# Altium schematic sheet EVK-IRIS-W1-MCULINK-MUX.SchDoc
size A3; DocumentNumber: 6; SheetNumber: 6; SheetTotal: 14
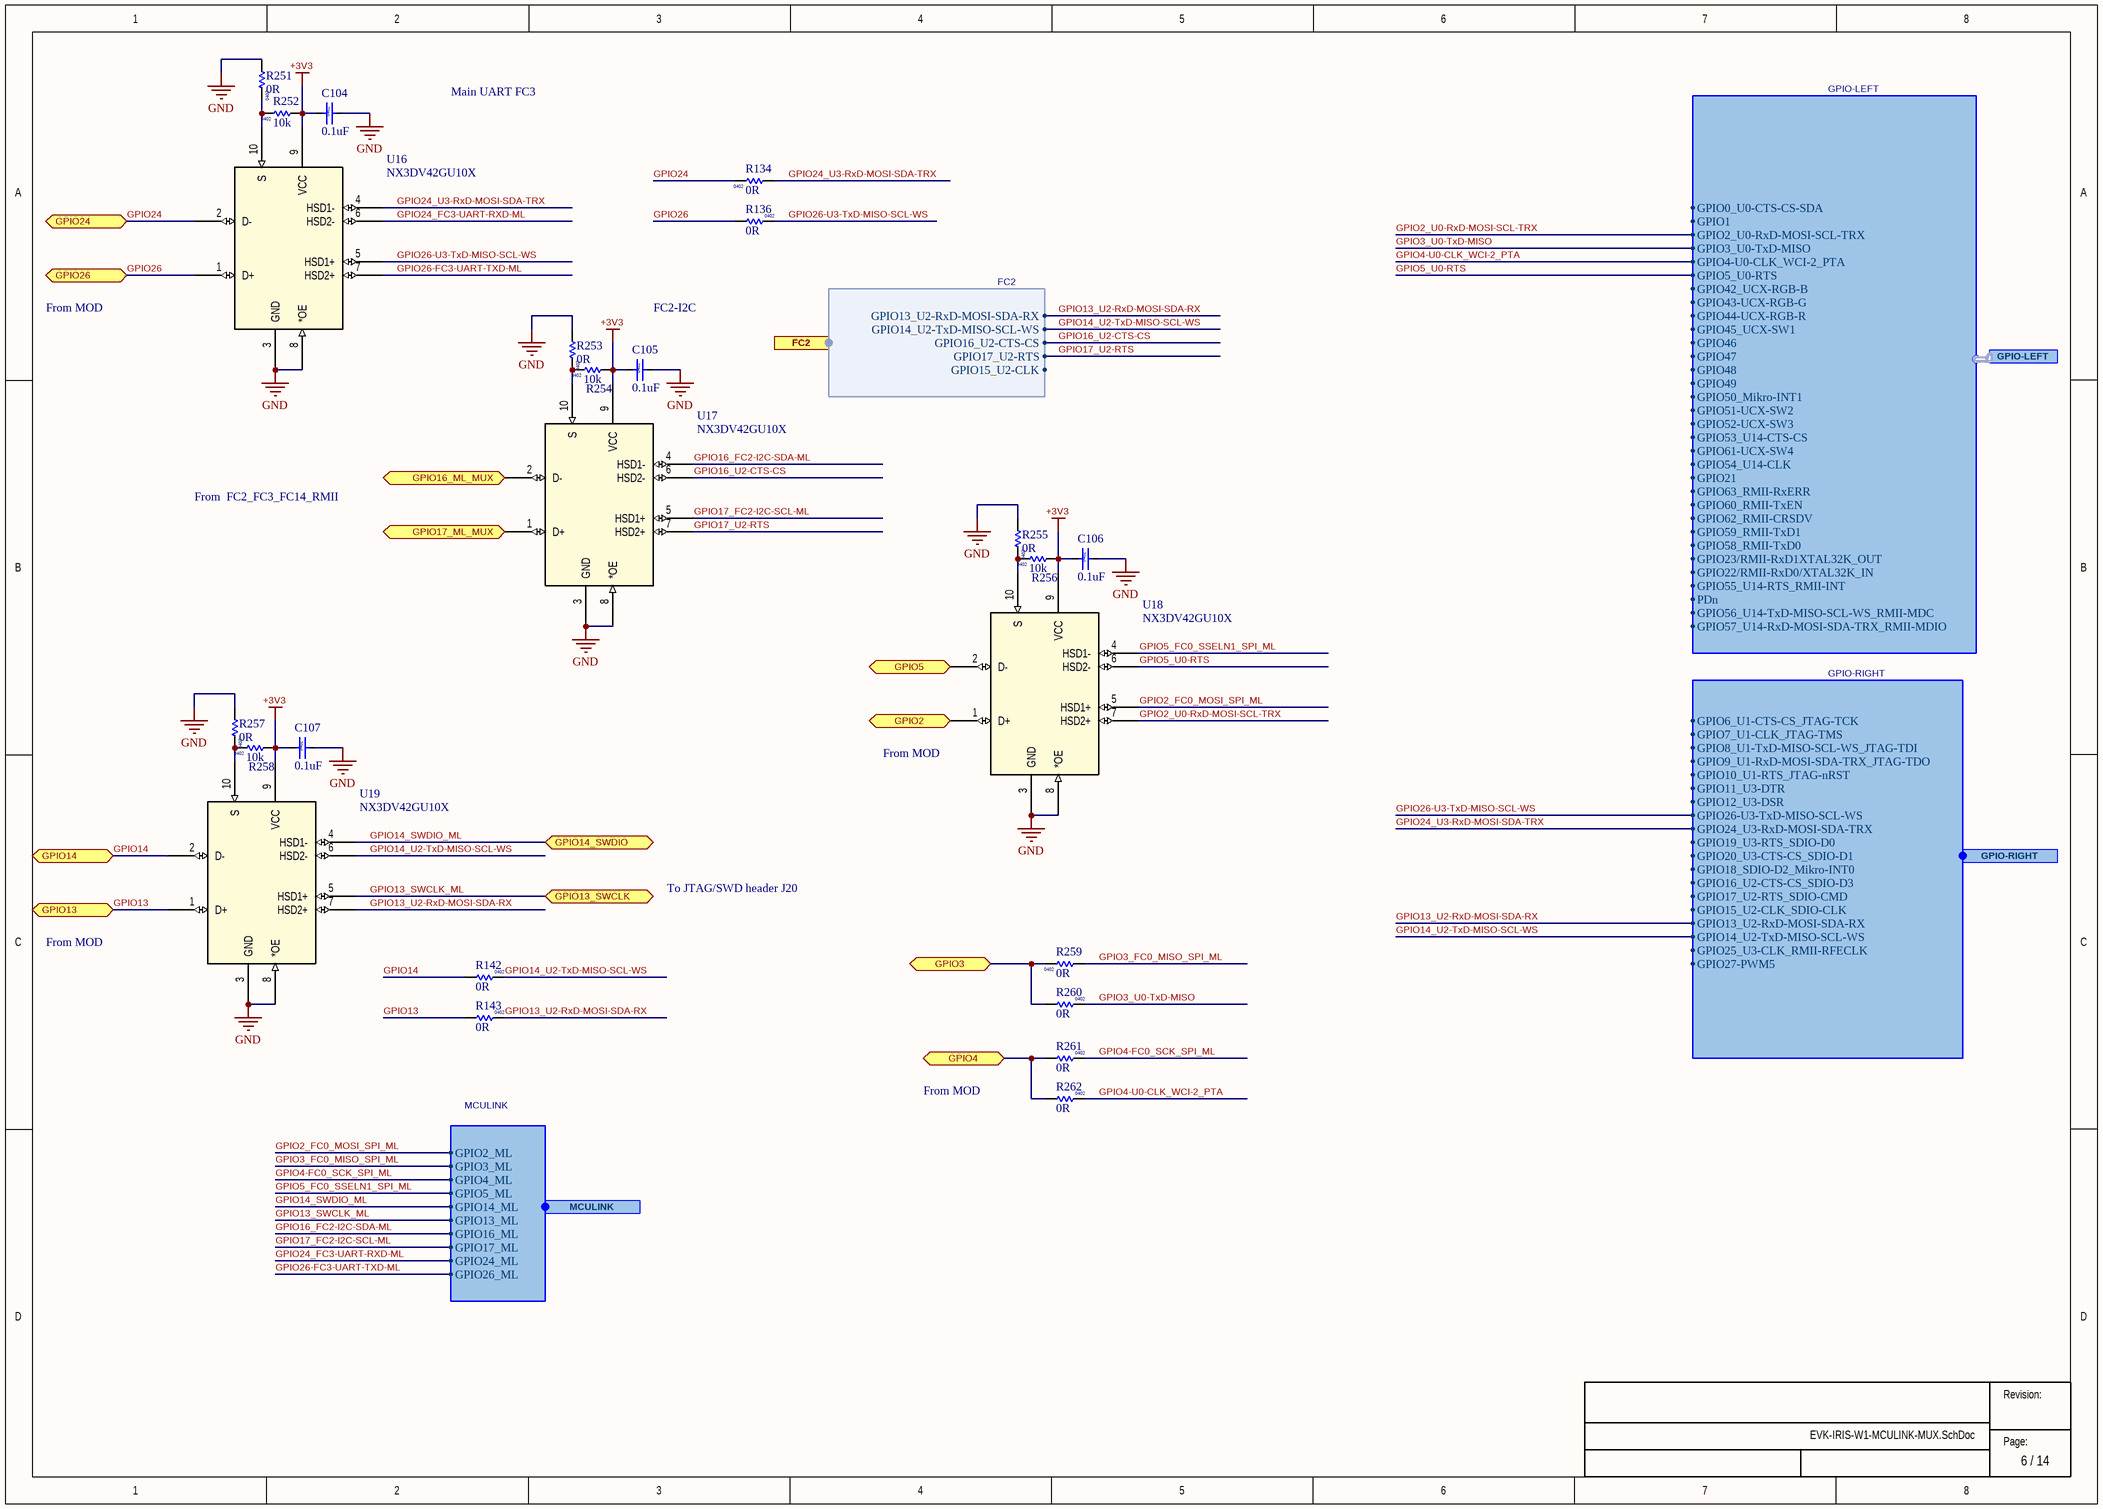
[diagram p0: EVK-IRIS-W1-MCULINK-MUX.SchDoc]

## Parts
C104  value 0.1uF  Size: 0402  [Cap 0402 HD]
C105  value 0.1uF  Size: 0402  [Cap 0402 HD]
C106  value 0.1uF  Size: 0402  [Cap 0402 HD]
C107  value 0.1uF  Size: 0402  [Cap 0402 HD]
R134  value 0R  Size: 0402  [RES 0402 HD]
R136  value 0R  Size: 0402  [RES 0402 HD]
R142  value 0R  Size: 0402  [RES 0402 HD]
R143  value 0R  Size: 0402  [RES 0402 HD]
R251  value 0R  Size: 0402  [RES 0402 HD]
R252  value 10k  Size: 0402  [RES 0402 HD]
R253  value 0R  Size: 0402  [RES 0402 HD]
R254  value 10k  Size: 0402  [RES 0402 HD]
R255  value 0R  Size: 0402  [RES 0402 HD]
R256  value 10k  Size: 0402  [RES 0402 HD]
R257  value 0R  Size: 0402  [RES 0402 HD]
R258  value 10k  Size: 0402  [RES 0402 HD]
R259  value 0R  Size: 0402  [RES 0402 HD]
R260  value 0R  Size: 0402  [RES 0402 HD]
R261  value 0R  Size: 0402  [RES 0402 HD]
R262  value 0R  Size: 0402  [RES 0402 HD]
U16  NX3DV42GU10X  [XQFN10_SOT1337-1_NXP]
U17  NX3DV42GU10X  [XQFN10_SOT1337-1_NXP]
U18  NX3DV42GU10X  [XQFN10_SOT1337-1_NXP]
U19  NX3DV42GU10X  [XQFN10_SOT1337-1_NXP]

## Ports
FC2 (harness FC2), GPIO2 (bidir), GPIO3 (bidir), GPIO4 (bidir), GPIO5 (bidir), GPIO13 (bidir), GPIO13_SWCLK (bidir), GPIO14 (bidir), GPIO14_SWDIO (bidir), GPIO16_ML_MUX (bidir), GPIO17_ML_MUX (bidir), GPIO24 (bidir), GPIO26 (bidir), GPIO-LEFT (harness GPIO-LEFT), GPIO-RIGHT (harness GPIO-RIGHT), MCULINK (harness MCULINK)

## Harnesses
GPIO-RIGHT: GPIO6_U1-CTS-CS_JTAG-TCK, GPIO7_U1-CLK_JTAG-TMS, GPIO8_U1-TxD-MISO-SCL-WS_JTAG-TDI, GPIO9_U1-RxD-MOSI-SDA-TRX_JTAG-TDO, GPIO10_U1-RTS_JTAG-nRST, GPIO11_U3-DTR, GPIO12_U3-DSR, GPIO26-U3-TxD-MISO-SCL-WS, GPIO24_U3-RxD-MOSI-SDA-TRX, GPIO19_U3-RTS_SDIO-D0, GPIO20_U3-CTS-CS_SDIO-D1, GPIO18_SDIO-D2_Mikro-INT0, GPIO16_U2-CTS-CS_SDIO-D3, GPIO17_U2-RTS_SDIO-CMD, GPIO15_U2-CLK_SDIO-CLK, GPIO13_U2-RxD-MOSI-SDA-RX, GPIO14_U2-TxD-MISO-SCL-WS, GPIO25_U3-CLK_RMII-RFECLK, GPIO27-PWM5
GPIO-LEFT: GPIO0_U0-CTS-CS-SDA, GPIO1, GPIO2_U0-RxD-MOSI-SCL-TRX, GPIO3_U0-TxD-MISO, GPIO4-U0-CLK_WCI-2_PTA, GPIO5_U0-RTS, GPIO42_UCX-RGB-B, GPIO43-UCX-RGB-G, GPIO44-UCX-RGB-R, GPIO45_UCX-SW1, GPIO46, GPIO47, GPIO48, GPIO49, GPIO50_Mikro-INT1, GPIO51-UCX-SW2, GPIO52-UCX-SW3, GPIO53_U14-CTS-CS, GPIO61-UCX-SW4, GPIO54_U14-CLK, GPIO21, GPIO63_RMII-RxERR, GPIO60_RMII-TxEN, GPIO62_RMII-CRSDV, GPIO59_RMII-TxD1, GPIO58_RMII-TxD0, GPIO23/RMII-RxD1XTAL32K_OUT, GPIO22/RMII-RxD0/XTAL32K_IN, GPIO55_U14-RTS_RMII-INT, PDn, GPIO56_U14-TxD-MISO-SCL-WS_RMII-MDC, GPIO57_U14-RxD-MOSI-SDA-TRX_RMII-MDIO
MCULINK: GPIO2_ML, GPIO3_ML, GPIO4_ML, GPIO5_ML, GPIO13_ML, GPIO14_ML, GPIO16_ML, GPIO17_ML, GPIO24_ML, GPIO26_ML
FC2: GPIO13_U2-RxD-MOSI-SDA-RX, GPIO14_U2-TxD-MISO-SCL-WS, GPIO16_U2-CTS-CS, GPIO17_U2-RTS, GPIO15_U2-CLK

## Nets
+3V3: C104.1 C105.1 C106.1 C107.1 R252.1 R254.1 R256.1 R258.1 U16.9(VCC) U17.9(VCC) U18.9(VCC) U19.9(VCC)
GND: C104.2 C105.2 C106.2 C107.2 R251.1 R253.1 R255.1 R257.1 U16.3(GND) U16.8(*OE) U17.3(GND) U17.8(*OE) U18.3(GND) U18.8(*OE) U19.3(GND) U19.8(*OE)
GPIO2: U18.1(D+) ; port GPIO2
GPIO2_FC0_MOSI_SPI_ML: U18.5(HSD1+) ; port MCULINK.GPIO2_ML
GPIO2_U0-RxD-MOSI-SCL-TRX: U18.7(HSD2+) ; port GPIO-LEFT.GPIO2_U0-RxD-MOSI-SCL-TRX
GPIO3: R259.2 R260.1 ; port GPIO3
GPIO3_FC0_MISO_SPI_ML: R259.1 ; port MCULINK.GPIO3_ML
GPIO3_U0-TxD-MISO: R260.2 ; port GPIO-LEFT.GPIO3_U0-TxD-MISO
GPIO4: R261.1 R262.1 ; port GPIO4
GPIO4-FC0_SCK_SPI_ML: R261.2 ; port MCULINK.GPIO4_ML
GPIO4-U0-CLK_WCI-2_PTA: R262.2 ; port GPIO-LEFT.GPIO4-U0-CLK_WCI-2_PTA
GPIO5: U18.2(D-) ; port GPIO5
GPIO5_FC0_SSELN1_SPI_ML: U18.4(HSD1-) ; port MCULINK.GPIO5_ML
GPIO5_U0-RTS: U18.6(HSD2-) ; port GPIO-LEFT.GPIO5_U0-RTS
GPIO13: R143.1 U19.1(D+) ; port GPIO13
GPIO13_SWCLK_ML: U19.5(HSD1+) ; port GPIO13_SWCLK, port MCULINK.GPIO13_ML
GPIO13_U2-RxD-MOSI-SDA-RX: R143.2 U19.7(HSD2+) ; port GPIO-RIGHT.GPIO13_U2-RxD-MOSI-SDA-RX, port FC2.GPIO13_U2-RxD-MOSI-SDA-RX
GPIO14: R142.1 U19.2(D-) ; port GPIO14
GPIO14_SWDIO_ML: U19.4(HSD1-) ; port GPIO14_SWDIO, port MCULINK.GPIO14_ML
GPIO14_U2-TxD-MISO-SCL-WS: R142.2 U19.6(HSD2-) ; port GPIO-RIGHT.GPIO14_U2-TxD-MISO-SCL-WS, port FC2.GPIO14_U2-TxD-MISO-SCL-WS
GPIO16_FC2-I2C-SDA-ML: U17.4(HSD1-) ; port MCULINK.GPIO16_ML
GPIO16_ML_MUX: U17.2(D-) ; port GPIO16_ML_MUX
GPIO16_U2-CTS-CS: U17.6(HSD2-) ; port FC2.GPIO16_U2-CTS-CS
GPIO17_FC2-I2C-SCL-ML: U17.5(HSD1+) ; port MCULINK.GPIO17_ML
GPIO17_ML_MUX: U17.1(D+) ; port GPIO17_ML_MUX
GPIO17_U2-RTS: U17.7(HSD2+) ; port FC2.GPIO17_U2-RTS
GPIO24: R134.2 U16.2(D-) ; port GPIO24
GPIO24_FC3-UART-RXD-ML: U16.6(HSD2-) ; port MCULINK.GPIO24_ML
GPIO24_U3-RxD-MOSI-SDA-TRX: R134.1 U16.4(HSD1-) ; port GPIO-RIGHT.GPIO24_U3-RxD-MOSI-SDA-TRX
GPIO26: R136.1 U16.1(D+) ; port GPIO26
GPIO26-FC3-UART-TXD-ML: U16.7(HSD2+) ; port MCULINK.GPIO26_ML
GPIO26-U3-TxD-MISO-SCL-WS: R136.2 U16.5(HSD1+) ; port GPIO-RIGHT.GPIO26-U3-TxD-MISO-SCL-WS
NetR251_2: R251.2 R252.2 U16.10(S)
NetR253_2: R253.2 R254.2 U17.10(S)
NetR255_2: R255.2 R256.2 U18.10(S)
NetR257_2: R257.2 R258.2 U19.10(S)

## Notes on the sheet
- Main UART FC3
- From MOD
- FC2-I2C
- From  FC2_FC3_FC14_RMII
- To JTAG/SWD header J20
- Revision:
- Page:

## Library data of the parts
C104-C107 = 120-00016: Cap, Ceramic 0.1uF 10V 10% X5R 0402; Manufacturer 1: Murata Electronics North America; Manufacturer Part Number 1: GRM155R61A104KA01J; Part Name: CAP CER 0.1UF 10V 10% X5R 0402; Item Phase: In Production; Tolerance: +/- 10%; Use in new designs: Yes; UBX Code: None; Part Number: 120-00016; Supplier 1: Digi-Key; Supplier Part Number 1: 490-6297-1-ND; Manufacturer 2: Yageo; Manufacturer Part Number 2: CC0402KRX5R6BB104; Supplier 2: Digi-Key; Supplier Part Number 2: 311-1336-1-ND; Height: 0.55mm; Max Operating Temp: 85; Min Operating Temp: -55; Pins: 2; Revision: 0A; Temperature Coefficient: X5R; Voltage: 10V
R134 R136 R142 R143 R251 R253 R255 R257 R259-R262 = UBXH18-0003002: RES THICK FILM CHIP 0402 0R 0 100mW; Manufacturer: KOA; Manufacturer P/N: RK73Z1ETTD; Tolerance: 0; Editor: charlotte.biber; Released by: peter.mueller; Env: ROHS; Permitted Use: Volume Products; Perferred: PREF; Mfg P/N Status: NRND; Mfg P/N Split: 100; Mfg P/N Released: Yes; Part Number: UBXH18-0003002; Manufacturer 2: YAGEO; Max Power: 100mW; Part Type: Resistor; Release Data: 2012-06-05T09:49:55; UBX Wiki: https://wiki.u-blox.com/bin/view/Operations/PartDetails?index=6611; RefDes: R; Manufacturer P/N 2: 2322_705_91001_L; Mfg P/N Status 2: NRND; Mfg P/N Split 2: 0; Mfg P/N Released 2: Yes
R252 R254 R256 R258 = 180-00024: Resistor 10k ohm 1% 1/16W, 0402; Manufacturer 1: Samsung Electro-Mechanics America, Inc; Manufacturer Part Number 1: RC1005F103CS; Part Name: RES SMD 10K OHM 1% 1/16W 0402; Item Phase: In Production; Tolerance: +/- 1%; Use in new designs: Yes; UBX Code: None; Part Number: 180-00024; Supplier 1: Digi-Key; Supplier Part Number 1: 1276-3431-1-ND; Manufacturer 2: Hong Kong Resistors Manufactory; Manufacturer Part Number 2: RCT0210KFLF; Supplier 2: None; Supplier Part Number 2: None; Height: 0.4mm; Max Operating Temp: 155; Min Operating Temp: -55; Pins: 2; Power: 1/16W; Revision: 0E; Voltage: N/A
U16-U19 = NX3DV42GU10X: No Description Available; Mfr_Name: NXP; Copyright: Copyright (C) 2023 Ultra Librarian. All rights reserved.; Manufacturer_Part_Number: NX3DV42GU10X; RefDes: RefDes; Type: DEV